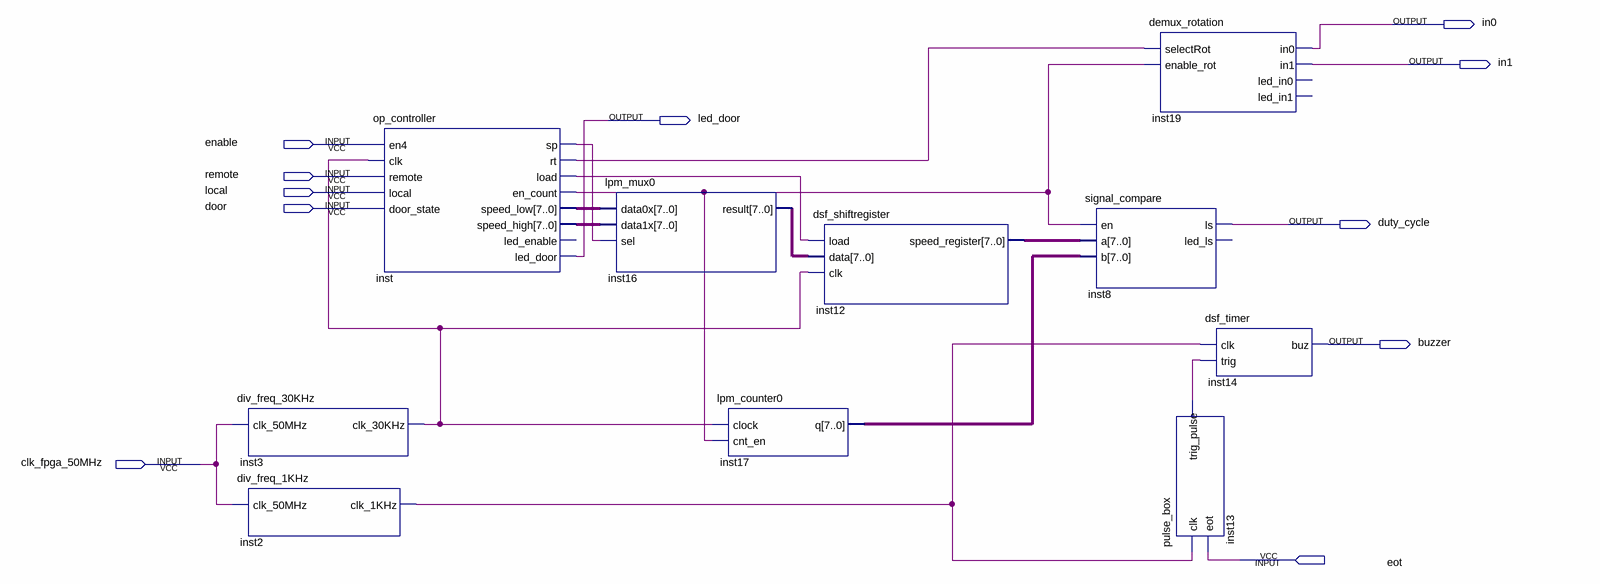
[diagram p0: schematic sheet]
// Quartus schematic operation.bdf as structural Verilog: 10 symbols, 11 pins
module operation (
  input  enable,
  input  remote,
  input  \local ,
  input  door,
  input  clk_fpga_50MHz,
  input  eot,
  output in0,
  output in1,
  output led_door,
  output duty_cycle,
  output buzzer
);

  wire inst2_clk_1khz, inst3_clk_30khz, inst13_trig_pulse, inst_en_count, inst_load, inst_rt, inst_sp;
  wire [7:0] inst12_speed_register, inst16_result, inst17_q, inst_speed_high, inst_speed_low;

  div_freq_30KHz inst3 (.clk_50MHz(clk_fpga_50MHz), .clk_30KHz(inst3_clk_30khz));
  div_freq_1KHz inst2 (.clk_50MHz(clk_fpga_50MHz), .clk_1KHz(inst2_clk_1khz));
  op_controller inst (
    .en4(enable), .clk(inst3_clk_30khz), .remote(remote), .\local (\local ), .door_state(door), .sp(inst_sp),
    .rt(inst_rt), .load(inst_load), .en_count(inst_en_count), .speed_low(inst_speed_low),
    .speed_high(inst_speed_high), .led_door(led_door));  // open: led_enable
  lpm_mux0 inst16 (.data0x(inst_speed_low), .data1x(inst_speed_high), .sel(inst_sp), .result(inst16_result));
  lpm_counter0 inst17 (.clock(inst3_clk_30khz), .cnt_en(inst_en_count), .q(inst17_q));
  dsf_shiftregister inst12 (
    .load(inst_load), .data(inst16_result), .clk(inst3_clk_30khz), .speed_register(inst12_speed_register));
  signal_compare inst8 (.en(inst_en_count), .a(inst12_speed_register), .b(inst17_q), .ls(duty_cycle));  // open: led_ls
  demux_rotation inst19 (
    .selectRot(inst_rt), .enable_rot(inst_en_count), .in0(in0), .in1(in1));  // open: led_in0, led_in1
  pulse_box inst13 (.clk(inst2_clk_1khz), .eot(eot), .trig_pulse(inst13_trig_pulse));
  dsf_timer inst14 (.clk(inst2_clk_1khz), .trig(inst13_trig_pulse), .buz(buzzer));
endmodule
